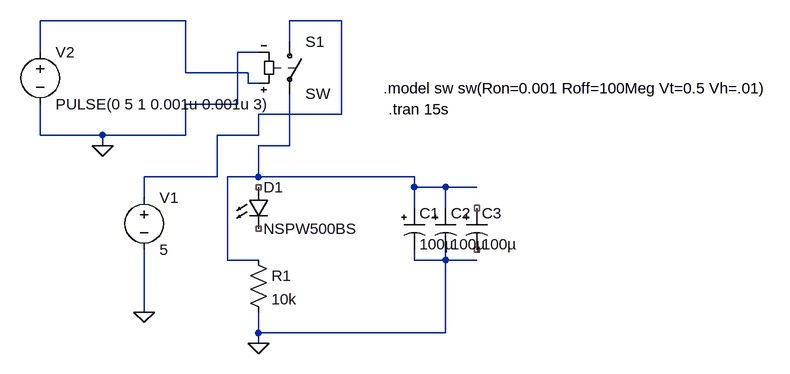
[diagram p0: schematic Capacitors.asc]
Capacitors.asc, the LTspice schematic file:
Version 4
SHEET 1 908 680
WIRE -48 -192 -272 -192
WIRE 192 -192 112 -192
WIRE 112 -160 112 -192
WIRE -272 -144 -272 -192
WIRE 64 -144 32 -144
WIRE -48 -112 -48 -192
WIRE 48 -112 -48 -112
WIRE 48 -96 48 -112
WIRE 64 -96 48 -96
WIRE 32 -64 32 -144
WIRE 32 -64 -48 -64
WIRE 192 -48 192 -192
WIRE 192 -48 64 -48
WIRE -272 -16 -272 -64
WIRE -176 -16 -272 -16
WIRE -48 -16 -48 -64
WIRE -48 -16 -176 -16
WIRE 64 -16 64 -48
WIRE 64 -16 0 -16
WIRE -176 0 -176 -16
WIRE 112 0 112 -80
WIRE 112 0 64 0
WIRE 0 48 0 -16
WIRE 0 48 -112 48
WIRE 64 48 64 0
WIRE 64 48 16 48
WIRE 304 48 64 48
WIRE 304 64 304 48
WIRE 352 64 304 64
WIRE 400 64 352 64
WIRE -112 80 -112 48
WIRE 304 96 304 64
WIRE 352 96 352 64
WIRE 16 176 16 48
WIRE 64 176 16 176
WIRE 304 176 304 160
WIRE 352 176 352 160
WIRE 352 176 304 176
WIRE 400 176 352 176
WIRE -112 256 -112 160
WIRE 64 288 64 256
WIRE 352 288 352 176
WIRE 352 288 64 288
WIRE 64 304 64 288
FLAG -112 256 0
FLAG 64 304 0
FLAG -176 0 0
SYMBOL voltage -112 64 R0
WINDOW 123 0 0 Left 0
WINDOW 39 0 0 Left 0
SYMATTR InstName V1
SYMATTR Value 5
SYMBOL LED 48 64 R0
SYMATTR InstName D1
SYMATTR Value NSPW500BS
SYMBOL polcap 288 96 R0
WINDOW 3 24 56 Left 2
SYMATTR InstName C1
SYMATTR Value 100µ
SYMATTR Description Capacitor
SYMATTR Type cap
SYMATTR SpiceLine V=25 Irms=250m Rser=0.6 Lser=0 mfg="Nichicon" pn="UPG1E101MPH" type="Al electrolytic"
SYMBOL polcap 336 96 R0
WINDOW 3 24 56 Left 2
SYMATTR InstName C2
SYMATTR Value 100µ
SYMATTR Description Capacitor
SYMATTR Type cap
SYMATTR SpiceLine V=25 Irms=145m Rser=0.62 Lser=0 mfg="Nichicon" pn="UPR1E101MPH" type="Al electrolytic"
SYMBOL polcap 384 96 R0
WINDOW 3 24 56 Left 2
SYMATTR InstName C3
SYMATTR Value 100µ
SYMATTR Description Capacitor
SYMATTR Type cap
SYMATTR SpiceLine V=25 Irms=145m Rser=0.62 Lser=0 mfg="Nichicon" pn="UPR1E101MPH" type="Al electrolytic"
SYMBOL res 48 160 R0
SYMATTR InstName R1
SYMATTR Value 10k
SYMATTR SpiceLine tol=1
SYMBOL voltage -272 -160 R0
WINDOW 123 0 0 Left 0
WINDOW 39 0 0 Left 0
SYMATTR InstName V2
SYMATTR Value PULSE(0 5 1 0.001u 0.001u 3)
SYMBOL sw 112 -176 R0
SYMATTR InstName S1
TEXT 256 -88 Left 2 !.model sw sw(Ron=0.001 Roff=100Meg Vt=0.5 Vh=.01)
TEXT 264 -56 Left 2 !.tran 15s

The netlist it stands for:
* Capacitors.asc
V1 N002 0 5
D1 NC_01 NC_02 NSPW500BS
C1 N003 0 100µ V=25 Irms=250m Rser=0.6 Lser=0 mfg="Nichicon" pn="UPG1E101MPH" type="Al electrolytic"
C2 N003 0 100µ V=25 Irms=145m Rser=0.62 Lser=0 mfg="Nichicon" pn="UPR1E101MPH" type="Al electrolytic"
C3 NC_03 NC_04 100µ V=25 Irms=145m Rser=0.62 Lser=0 mfg="Nichicon" pn="UPR1E101MPH" type="Al electrolytic"
R1 N003 0 10k tol=1
V2 N001 0 PULSE(0 5 1 0.001u 0.001u 3)
S1 N002 N003 N001 0 SW
.model D D
.lib standard.dio
.model sw sw(Ron=0.001 Roff=100Meg Vt=0.5 Vh=.01)
.tran 15s
.backanno
.end